# EAGLE design DynamixelShield (EAGLE 6.5.0)
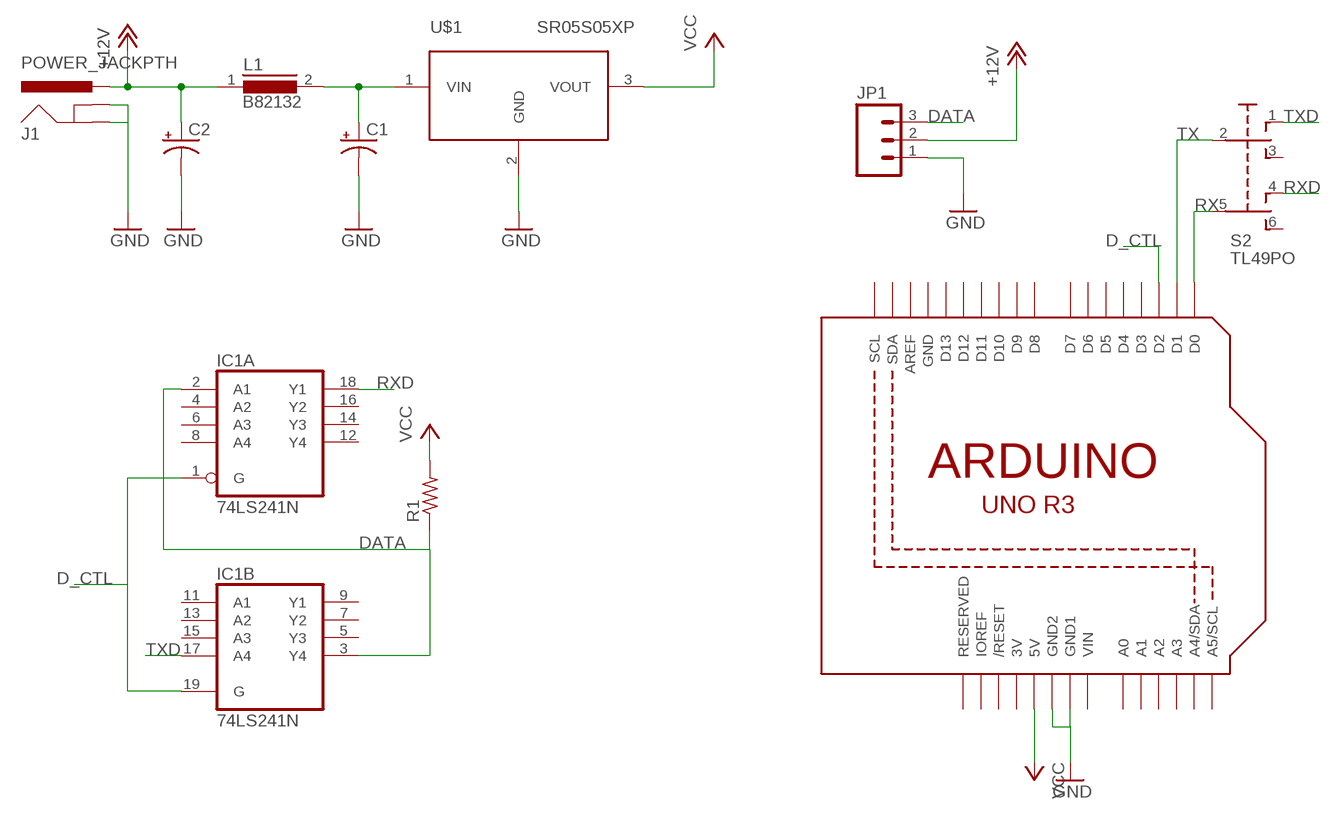
[diagram p0: schematic, sheet 1]

## Parts
C1  CPOL-USE3.5-10  [E3,5-10]
C2  CPOL-USE3.5-10  [E3,5-10]
IC1  74LS241N  [DIL20]
J1  POWER_JACKPTH  [POWER_JACK_PTH]
JP1  M031X03_NO_SILK  [1X03_NO_SILK]
L1  B82132  [SUKW2-22]
R1  R-US_0204/7  [0204/7]
S2  TL49PO  [TL4XPO]
U1  ARDUINOR3-DIMENSION  [ARDUINOR3]
U$1  SR05S05XP  [XP_3PIN_SIP]

## Nets
+12V: C2.+ J1.PWR JP1.2 L1.1
D_CTL: IC1.1(A:G) IC1.19(B:G) U1.D2
DATA: IC1.2(A:A1) IC1.3(B:Y4) JP1.3 R1.1
GND: C1.- C2.- J1.GND J1.GNDBREAK JP1.1 U1.GND1 U1.GND2 U$1.2(GND)
N$1: C1.+ L1.2 U$1.1(VIN)
RX: S2.5(P1) U1.D0
RXD: IC1.18(A:Y1) S2.4(O1)
TX: S2.2(P) U1.D1
TXD: IC1.17(B:A4) S2.1(O)
VCC: R1.2 U1.5V U$1.3(VOUT)
Unconnected: IC1.4(A:A2) IC1.5(B:Y3) IC1.6(A:A3) IC1.7(B:Y2) IC1.8(A:A4) IC1.9(B:Y1) IC1.11(B:A1) IC1.12(A:Y4) IC1.13(B:A2) IC1.14(A:Y3) IC1.15(B:A3) IC1.16(A:Y2) S2.3(S) S2.6(S1) U1.A0 U1.A1 U1.A2 U1.A3 U1.A4(A4/SDA) U1.A5(A5/SCL) U1.AREF U1.D3 U1.D4 U1.D5 U1.D6 U1.D7 U1.D8 U1.D9 U1.D10 U1.D11 U1.D12 U1.D13 U1.IOREF U1.RESERVED U1.RESET(/RESET) U1.SCL U1.SDA

## Power pins joined to a net without a drawn wire
3V: U1.3V
GND: IC1.10(P:GND) U1.GND
VCC: IC1.20(P:VCC)
VIN: U1.VIN

## Library data of the parts
C1 C2 = rcl:CPOL-US: POLARIZED CAPACITOR, American symbol
IC1 = 74xx-us:74*241: Octal BUFFER and LINE DRIVER, 3-state
J1 = SparkFun-Connectors:POWER_JACK: Power Jack This is the standard 5.5mm barrel jack for power. The PTH is the most common, proven, reliable, footprint. The Slot footprint only works if the mill layer is transmitted to the PCB fab house so be warned. Spark Fun Electronics SKU : PRT-00119 SMT: CONN-08106 Mating wall wart : TOL-00298 (and others)
JP1 = SparkFun-Connectors:M03: Header 3 Standard 3-pin 0.1" header. Use with straight break away headers (SKU : PRT-00116), right angle break away headers (PRT-00553), swiss pins (PRT-00743), machine pins (PRT-00117), and female headers (PRT-00115). Molex polarized connector foot print use with SKU : PRT-08232 with associated crimp pins and housings.
L1 = inductors:B82132: INDUCTOR
R1 = rcl:R-US_: RESISTOR, American symbol
S2 = switch:TL49PO: TINY SWITCH ON OFF ON Source: http://www2.produktinfo.conrad.com/datenblaetter/700000-724999/705152-da-01-de-Subminiaturschalter_TL_36YO.pdf
U1 = adafruit:ARDUINOR3: This is a new object for the new Arduino R3 - with extra pins that you may want to use (such as IOref, and duplicated A4/A5
U$1 = EzerLonginus:SR05S05

## Board
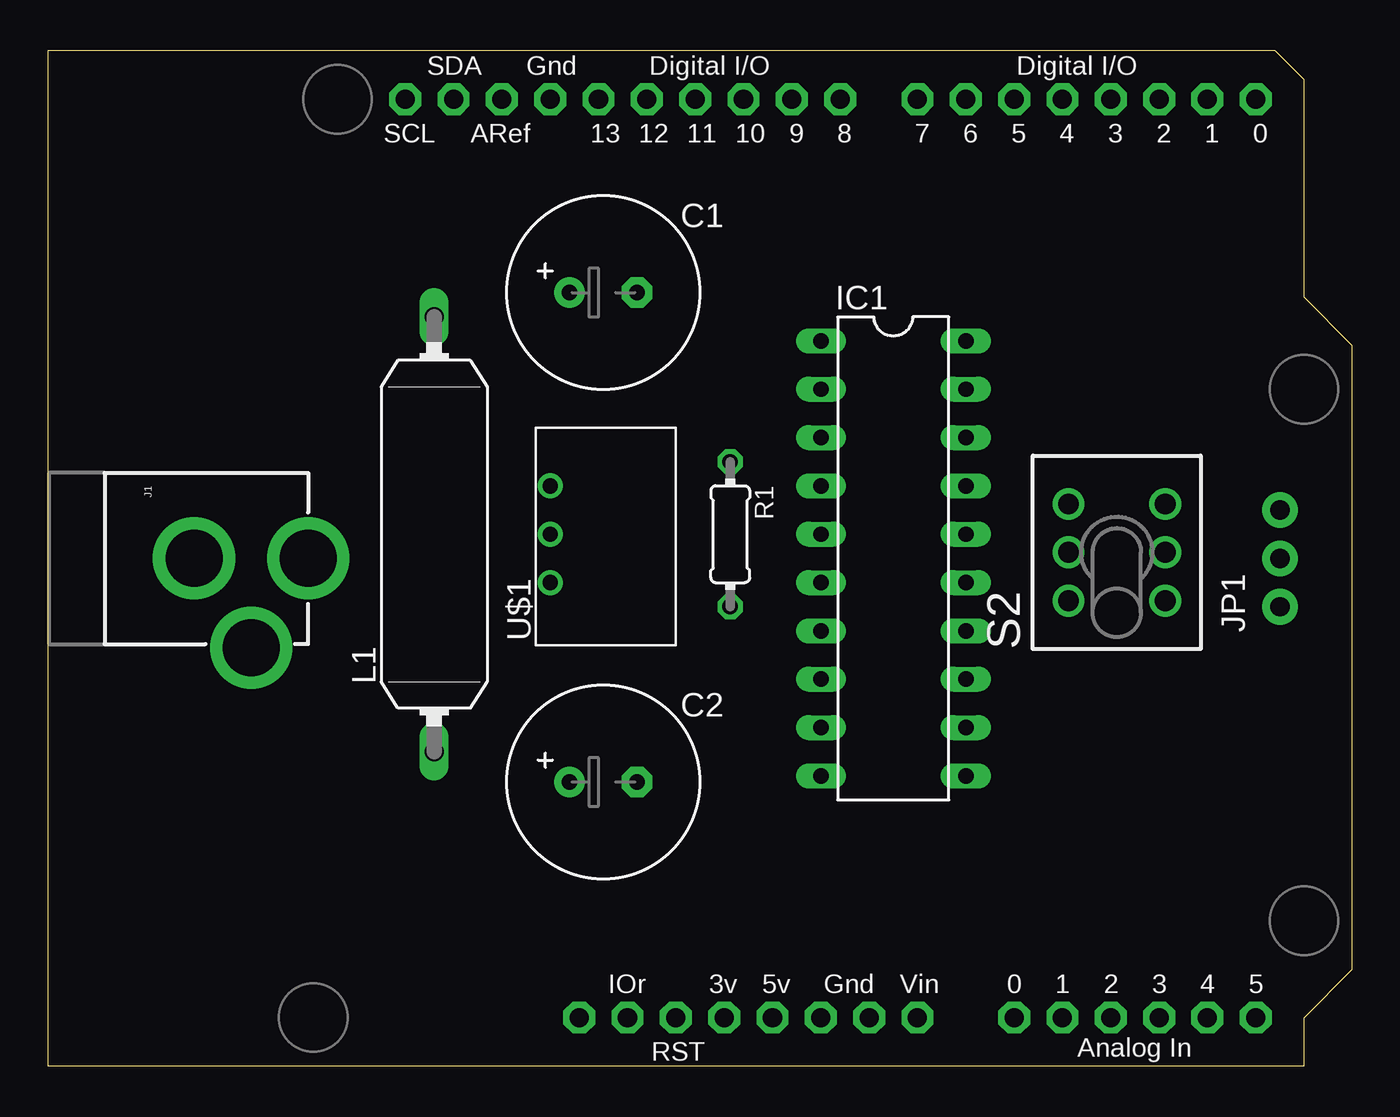
[diagram p1: board, top side]
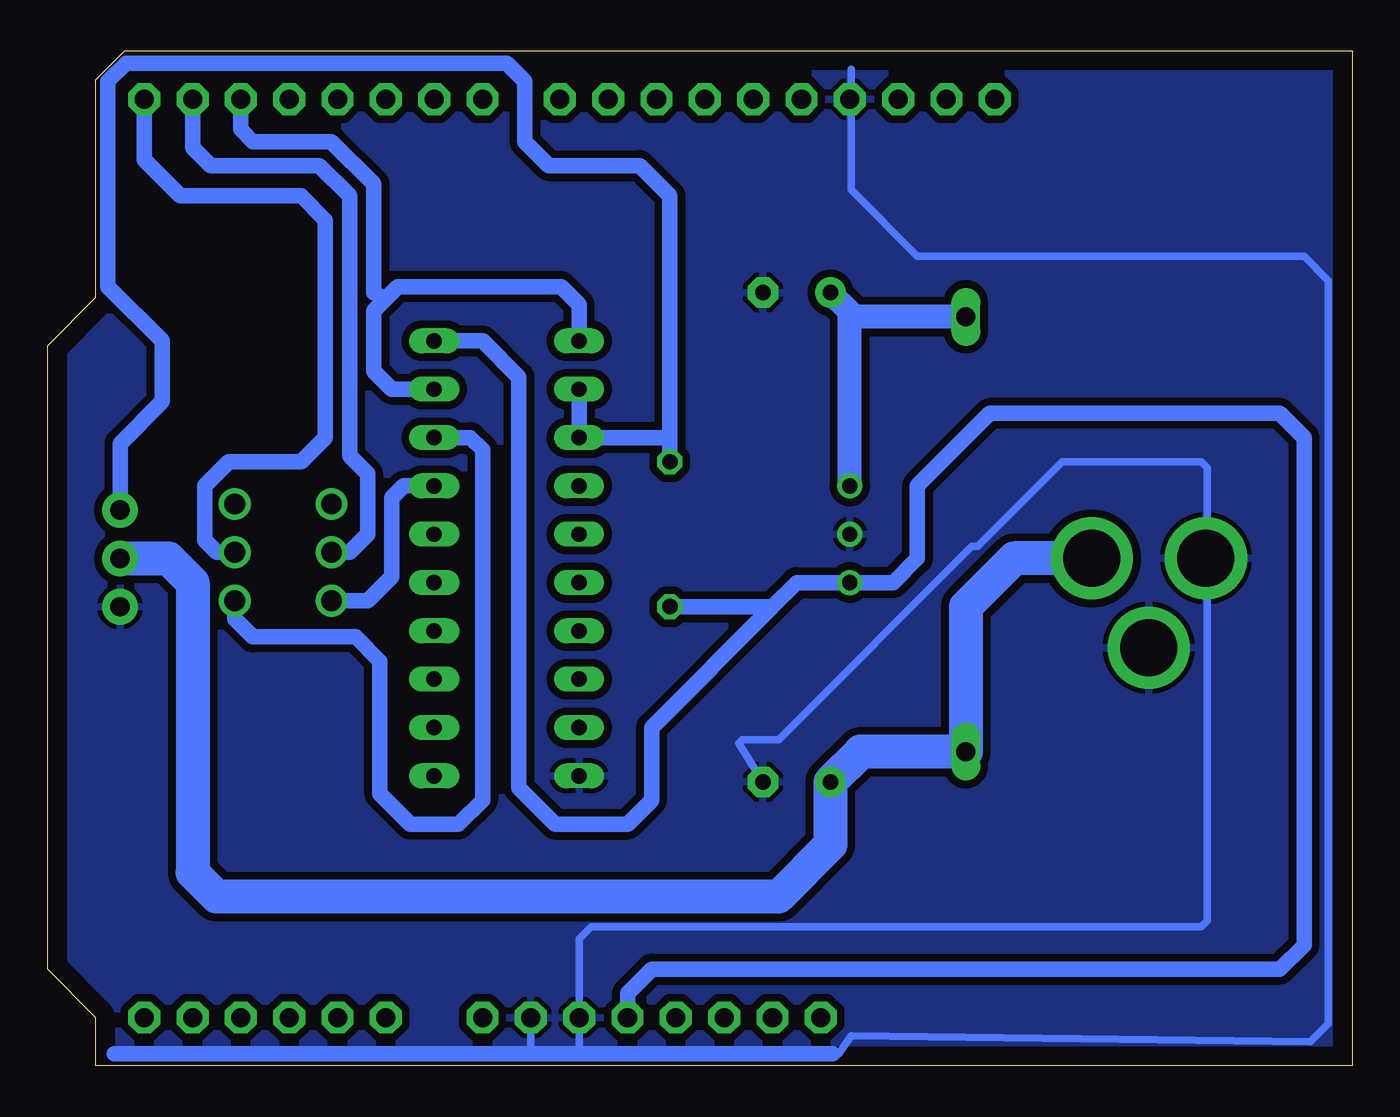
[diagram p2: board, bottom side, seen from below]

Size 68.58 x 53.34 mm. Coordinates in mm from the lower left corner, seen from the top.
Copper layers (1*16): Top 0.035mm / dielectric 1.5mm / Bottom 0.035mm
Design rules "default": minimum track width 10mil, minimum drill 24mil, track to track 8mil, track to pad 8mil, pad to pad 8mil, via to via 8mil, smd to smd 8mil, copper to edge 40mil, drill to drill 8mil, minimum pad ring 10mil, minimum via ring 8mil, stop-mask expansion 4mil, vias tented up to drill 0mil, thermal gap 10mil

### Footprints (pad centres in the part's own frame; a part is rotated, then mirrored left to right if it is on the bottom)
E3,5-10 = drill 0.813 pad 1.6: + -1.778,0 | drill 0.813 pad 1.6 octagon: - 1.778,0
DIL20 = drill 0.813 long: 1 -11.43,-3.81; 2 -8.89,-3.81; 3 -6.35,-3.81; 4 -3.81,-3.81; 5 -1.27,-3.81; 6 1.27,-3.81; 7 3.81,-3.81; 8 6.35,-3.81; 9 8.89,-3.81; 10 11.43,-3.81; 11 11.43,3.81; 12 8.89,3.81; 13 6.35,3.81; 14 3.81,3.81; 15 1.27,3.81; 16 -1.27,3.81; 17 -3.81,3.81; 18 -6.35,3.81; 19 -8.89,3.81; 20 -11.43,3.81
POWER_JACK_PTH = drill 2.997 pad 4.318: GND 0,7.7; GNDBREAK 4.7,10.7; PWR 0,13.7
1X03_NO_SILK = drill 1.016 pad 1.88: 1 0,0; 2 2.54,0; 3 5.08,0
SUKW2-22 = drill 1.016 long: 1 -11.43,0; 2 11.43,0
0204/7 = drill 0.813 octagon: 1 -3.81,0; 2 3.81,0
TL4XPO = drill 1.1 pad 1.676: 1 -2.54,2.54; 2 0,2.54; 3 2.54,2.54; 4 -2.54,-2.54; 5 0,-2.54; 6 2.54,-2.54
ARDUINOR3 = drill 1 pad 1.676 octagon: 3V 35.56,2.54; 5V 38.1,2.54; A0 50.8,2.54; A1 53.34,2.54; A2 55.88,2.54; A3 58.42,2.54; A4 60.96,2.54; A5 63.5,2.54; AREF 23.876,50.8; D0 63.5,50.8; D1 60.96,50.8; D2 58.42,50.8; D3 55.88,50.8; D4 53.34,50.8; D5 50.8,50.8; D6 48.26,50.8; D7 45.72,50.8; D8 41.656,50.8; D9 39.116,50.8; D10 36.576,50.8; D11 34.036,50.8; D12 31.496,50.8; D13 28.956,50.8; GND 26.416,50.8; GND1 43.18,2.54; GND2 40.64,2.54; IOREF 30.48,2.54; RESERVED 27.94,2.54; RESET 33.02,2.54; SCL 18.796,50.8; SDA 21.336,50.8; VIN 45.72,2.54
XP_3PIN_SIP = drill 0.8: 1 2.54,2.794; 2 0,2.794; 3 -2.54,2.794

### Placement (x,y rotation side)
C1  29.21,40.64 0 top
C2  29.21,14.92 0 top
IC1  44.45,26.67 270 top
J1  0,26.67 270 top
JP1  64.77,24.13 90 top
L1  20.32,27.94 90 top
R1  35.88,27.94 270 top
S2  56.2,26.99 90 top
U1  0,0 0 top
U$1  29.21,27.94 90 top

### Tracks (layer width: path | path; a pad name or v marks a point on that pad's centre or on a via)
+12V
  Bottom 1.778: JP1.2 62.23,26.67 60.96,25.4 60.96,10.16 59.69,8.89 30.16,8.89 27.43,11.62 C2.+ 25.84,16.51 L1.1 20.32,24.13 17.78,26.67 J1.PWR
D_CTL
  Bottom 0.813: IC1.1 40.64,40.01 41.59,40.96 50.17,40.96 50.8,40.32 | 50.8,40.32 51.44,39.69 51.44,36.51 50.48,35.56 IC1.19 | U1.D2 58.42,49.21 57.79,48.58 53.66,48.58 51.44,46.35 51.44,40.64 50.8,40.32
DATA
  Bottom 0.813: IC1.2 IC1.3 35.88,33.02 R1.1 35.88,45.72 37.47,47.31 42.23,47.31 43.5,48.58 43.5,51.75 44.45,52.71 64.45,52.71 65.41,51.75 65.41,40.96 62.55,38.1 62.55,34.92 64.77,32.7 JP1.3
GND
  Bottom 0.406: 43.18,0.63 U1.GND1 | C2.- 32.26,16.95 32.07,17.15 30.16,17.15 20,27.3 19.68,27.3 15.24,31.75 7.94,31.75 7.62,31.43 7.62,7.62 7.94,7.3 40.01,7.3 40.64,6.67 40.64,0.63 26.99,0.63 26.35,1.59 2.22,1.27 1.27,2.22 1.27,41.27 2.54,42.55 22.86,42.55 26.35,46.04 26.35,50.74 | 26.35,50.74 U1.GND | 26.35,50.74 26.35,52.39
  Bottom 0.813: 27.31,0.63 40.64,0.63 43.18,0.63 65.09,0.63
  pour Bottom (isolate 0.406): 0,53.34 68.58,53.34 68.58,0 0,0
N$1
  Bottom 1.27: L1.2 26.16,39.37 26.42,39.62 | 26.42,39.62 C1.+ | U$1.1 26.42,39.62
RX
  Bottom 0.813: U1.D0 63.5,47.62 61.59,45.72 55.25,45.72 53.98,44.45 53.98,33.02 55.25,31.75 59.06,31.75 60.33,30.48 60.33,27.62 59.69,26.99 S2.5
RXD
  Bottom 0.813: IC1.18 46.36,33.02 45.72,32.38 45.72,13.97 46.99,12.7 49.53,12.7 51.12,14.29 51.12,21.27 52.39,22.54 57.79,22.54 58.74,23.49 S2.4
TX
  Bottom 0.813: U1.D1 60.96,48.26 60.01,47.31 54.29,47.31 52.7,45.72 52.7,32.07 51.75,31.12 51.75,27.94 52.7,26.99 S2.2
TXD
  Bottom 0.813: IC1.17 49.85,30.48 50.48,29.84 50.48,25.72 51.75,24.45 S2.1
VCC
  Bottom 0.813: IC1.20 45.72,38.1 43.81,36.2 43.81,14.6 41.91,12.7 38.1,12.7 36.83,13.97 36.83,17.78 30.48,24.13 | 30.48,24.13 29.21,25.4 U$1.3 24.13,25.4 22.86,26.67 22.86,30.48 19.05,34.29 3.81,34.29 2.54,33.02 2.54,6.35 3.81,5.08 36.83,5.08 38.1,3.81 U1.5V | R1.2 30.48,24.13